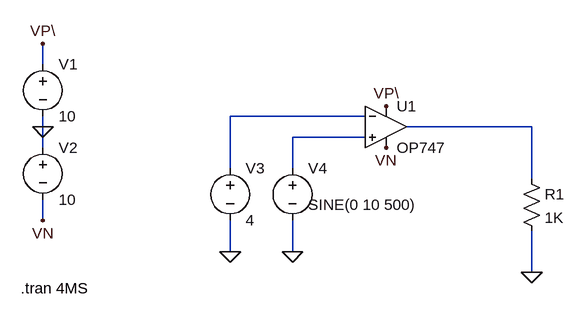
[diagram p0: schematic Comparator(Non-inverting).asc]
Comparator(Non-inverting).asc, the LTspice schematic file:
Version 4
SHEET 1 880 680
WIRE -256 -352 -256 -384
WIRE 240 -272 32 -272
WIRE -256 -256 -256 -272
WIRE 496 -256 304 -256
WIRE 240 -240 128 -240
WIRE -256 -224 -256 -256
WIRE 32 -192 32 -272
WIRE 128 -192 128 -240
WIRE 496 -176 496 -256
WIRE -256 -112 -256 -144
WIRE 32 -64 32 -112
WIRE 128 -64 128 -112
WIRE 496 -32 496 -96
FLAG 32 -64 0
FLAG 128 -64 0
FLAG 496 -32 0
FLAG -256 -256 0
FLAG -256 -384 VP\
FLAG 272 -288 VP\
FLAG -256 -112 VN
FLAG 272 -224 VN
SYMBOL OpAmps\\OP747 272 -320 R0
SYMATTR InstName U1
SYMBOL voltage 32 -208 R0
WINDOW 123 0 0 Left 0
WINDOW 39 0 0 Left 0
SYMATTR InstName V3
SYMATTR Value 4
SYMBOL voltage 128 -208 R0
WINDOW 123 24 44 Left 2
WINDOW 39 0 0 Left 0
WINDOW 3 24 72 Left 2
SYMATTR Value SINE(0 10 500)
SYMATTR InstName V4
SYMBOL res 480 -192 R0
SYMATTR InstName R1
SYMATTR Value 1K
SYMBOL voltage -256 -368 R0
WINDOW 123 0 0 Left 0
WINDOW 39 0 0 Left 0
SYMATTR InstName V1
SYMATTR Value 10
SYMBOL voltage -256 -240 R0
WINDOW 123 0 0 Left 0
WINDOW 39 0 0 Left 0
SYMATTR InstName V2
SYMATTR Value 10
TEXT -290 -8 Left 2 !.tran 4MS

The netlist it stands for:
* Comparator(Non-inverting).asc
XU1 N003 N001 VP\ VN N002 OP747  ; pins In+ In- V+ V- OUT
V3 N001 0 4
V4 N003 0 SINE(0 10 500)
R1 N002 0 1K
V1 VP\ 0 10
V2 0 VN 10
.tran 4MS
.backanno
.end